# EAGLE design DoubleMotorSwitch (EAGLE 6.6.0)
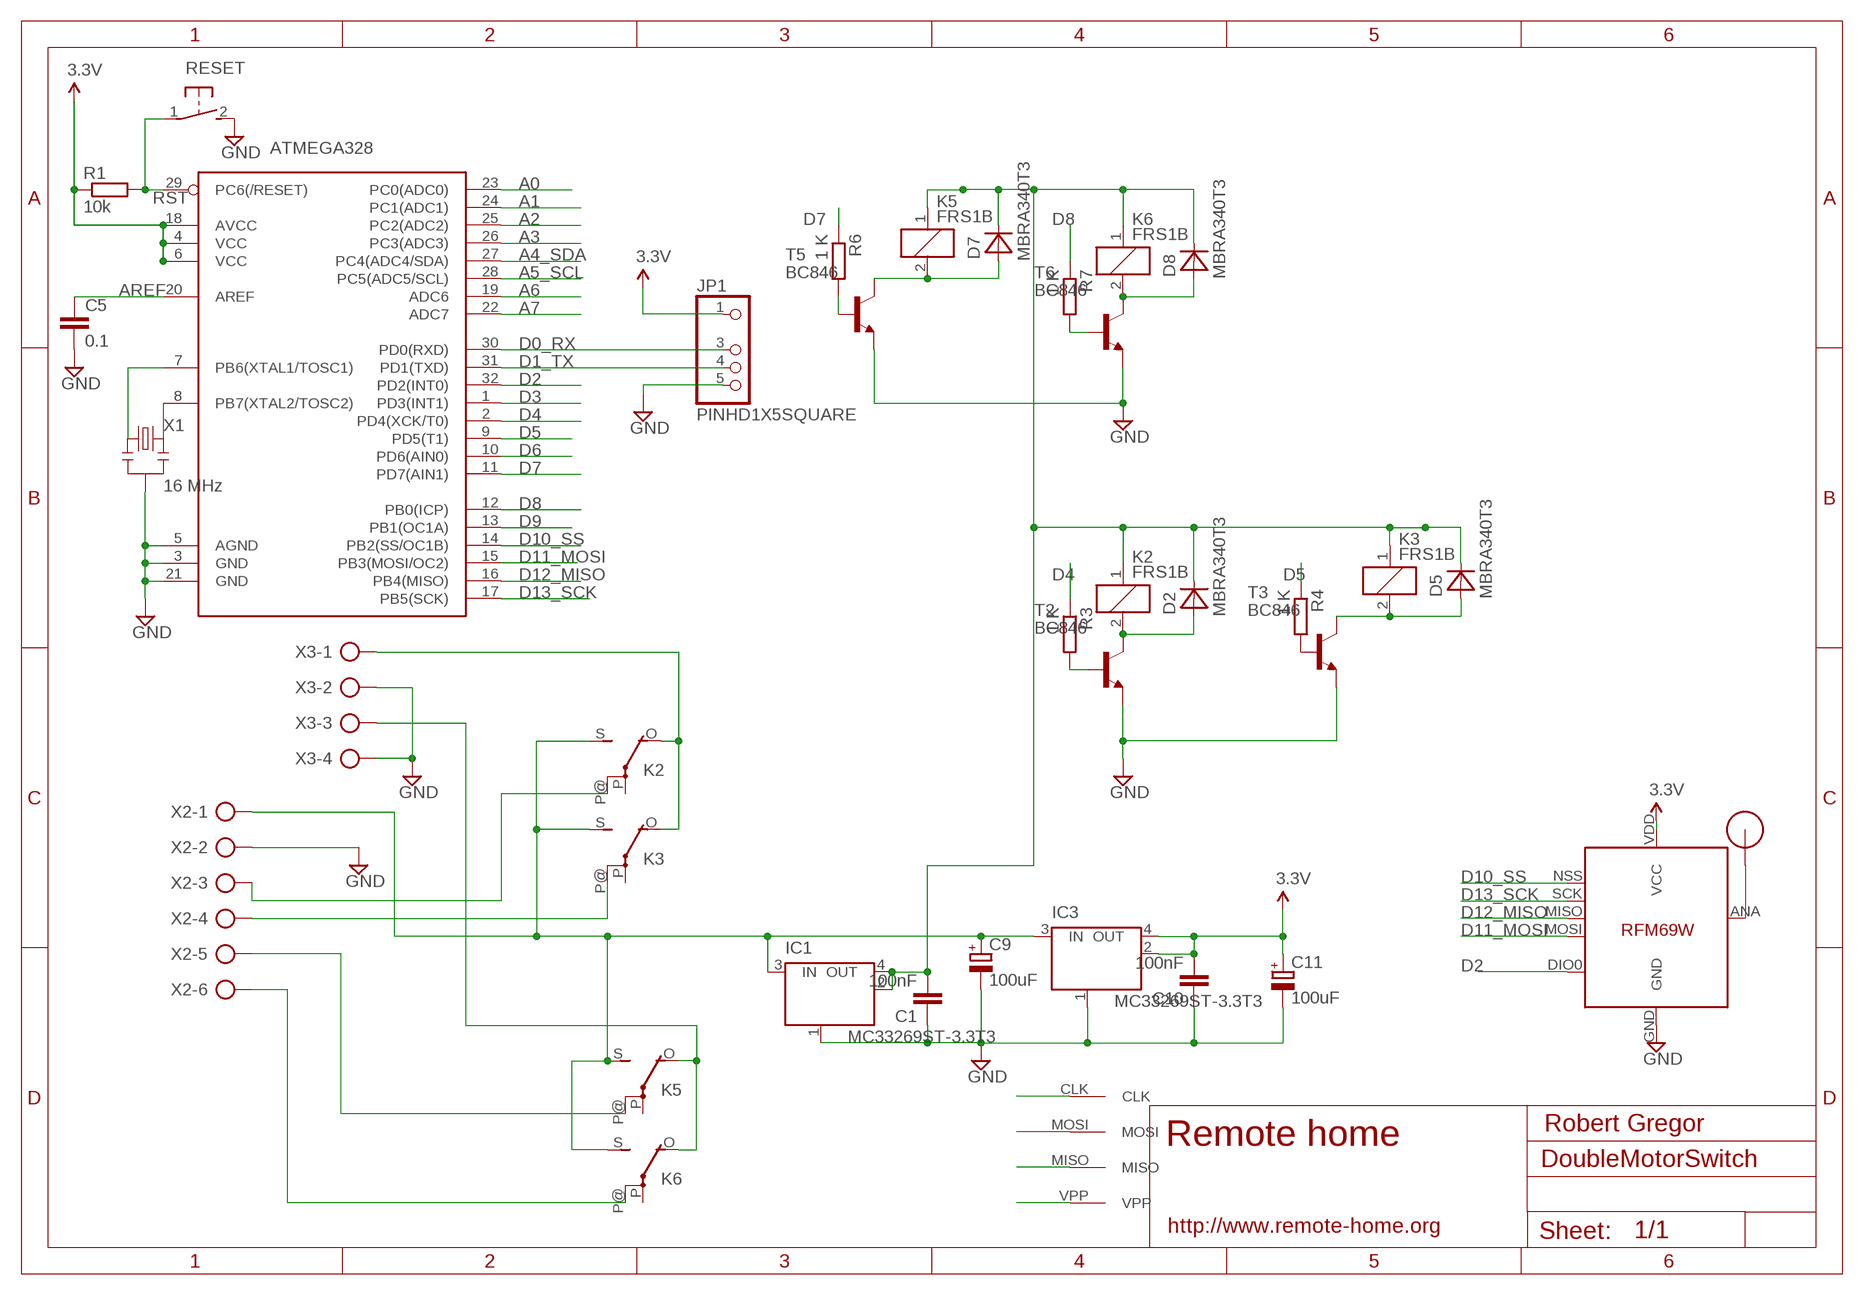
[diagram p0: schematic, sheet 1]

## Parts
ATMEGA328  ATMega-328  ATMEGA168/328TQFP32  [TQFP32-08]
C1  100nF  C-EUC2012  [C2012]
C5  0.1  C-EUC2012  [C2012]
C9  100uF  CPOL-EUSMCB  [SMC_B]
C10  100nF  C-EUC2012  [C2012]
C11  100uF  CPOL-EUSMCB  [SMC_B]
D2  MBRA340T3  [SMA]
D5  MBRA340T3  [SMA]
D7  MBRA340T3  [SMA]
D8  MBRA340T3  [SMA]
IC1  MC33269ST-3.3T3  [SOT223]
IC3  MC33269ST-3.3T3  [SOT223]
JP1  PINHD1X5SQUARE  [PINHD1X05-SQUARE]
K2  FRS1B  [FRS1B]
K3  FRS1B  [FRS1B]
K5  FRS1B  [FRS1B]
K6  FRS1B  [FRS1B]
R1  10k  R-EU_R2012  [R2012]
R3  1 K  R-EU_M2012  [M2012]
R4  1 K  R-EU_M2012  [M2012]
R6  1 K  R-EU_M2012  [M2012]
R7  1 K  R-EU_M2012  [M2012]
RESET  DTSM-3  [DTSM-3]
T2  BC846  [SOT23]
T3  BC846  [SOT23]
T5  BC846  [SOT23]
T6  BC846  [SOT23]
U$1  RFM12B_ANTENNA  [RFM12B-ANTENNA]
U$2  AVRHEADERDIP  [AVRHEADER]
U$5  RFM69  [RFM69W-MINPADS]
X1  16 MHz  RESONATORSMD  [RESONATOR-SMD]
X2  AK500/6  [AK500/6]
X3  AK500/4  [AK500/4]

## Nets
5V1: C1.2 D2.C D5.C D7.C D8.C IC1.2(OUT) IC1.4(OUT) K2.1 K3.1 K5.1 K6.1
A0: ATMEGA328.23(PC0(ADC0))
A1: ATMEGA328.24(PC1(ADC1))
A2: ATMEGA328.25(PC2(ADC2))
A3: ATMEGA328.26(PC3(ADC3))
A4_SDA: ATMEGA328.27(PC4(ADC4/SDA))
A5_SCL: ATMEGA328.28(PC5(ADC5/SCL))
A6: ATMEGA328.19(ADC6)
A7: ATMEGA328.22(ADC7)
AREF: ATMEGA328.20(AREF) C5.1
D0_RX: ATMEGA328.30(PD0(RXD)) JP1.3
D1_TX: ATMEGA328.31(PD1(TXD)) JP1.4
D2: ATMEGA328.32(PD2(INT0)) U$5.DIO0
D3: ATMEGA328.1(PD3(INT1))
D4: ATMEGA328.2(PD4(XCK/T0)) R3.1
D5: ATMEGA328.9(PD5(T1)) R4.1
D6: ATMEGA328.10(PD6(AIN0))
D7: ATMEGA328.11(PD7(AIN1)) R6.1
D8: ATMEGA328.12(PB0(ICP)) R7.1
D9: ATMEGA328.13(PB1(OC1A))
D10_SS: ATMEGA328.14(PB2(SS/OC1B)) U$5.NSS(SEL)
D11_MOSI: ATMEGA328.15(PB3(MOSI/OC2)) U$2.MOSI U$5.MOSI
D12_MISO: ATMEGA328.16(PB4(MISO)) U$2.MISO U$5.MISO
D13_SCK: ATMEGA328.17(PB5(SCK)) U$2.CLK U$5.SCK
GND [power]: ATMEGA328.3(GND) ATMEGA328.5(AGND) ATMEGA328.21(GND) C1.1 C5.2 C9.- C10.1 C11.- IC1.1(GND/ADJ) IC3.1(GND/ADJ) JP1.5 RESET.2 T2.2(E) T3.2(E) T5.2(E) T6.2(E) U$5.GND X1.2 X2.2 X3.2 X3.4
N$1: ATMEGA328.7(PB6(XTAL1/TOSC1)) X1.1
N$3: U$1.P$1 U$5.ANA(ANT)
N$4: D2.A K2.2 T2.3(C)
N$6: R3.2 T2.1(B)
N$7: K2.P@(2:P) X2.3
N$9: K2.O(2:O) K3.O(2:O) X3.1
N$11: K3.P@(2:P) X2.4
N$13: K5.O(2:O) K6.O(2:O) X3.3
N$15: C9.+ IC1.3(IN) IC3.3(IN) K2.S(2:S) K3.S(2:S) K5.S(2:S) K6.S(2:S) X2.1
N$16: K5.P@(2:P) X2.5
N$17: K6.P@(2:P) X2.6
N$21: ATMEGA328.8(PB7(XTAL2/TOSC2)) X1.3
N$22: D5.A K3.2 T3.3(C)
N$24: R4.2 T3.1(B)
N$27: D7.A K5.2 T5.3(C)
N$28: R6.2 T5.1(B)
N$29: D8.A K6.2 T6.3(C)
N$30: R7.2 T6.1(B)
RST: ATMEGA328.29(PC6(/RESET)) R1.2 RESET.1 U$2.VPP
VCC: ATMEGA328.4(VCC) ATMEGA328.6(VCC) ATMEGA328.18(AVCC) C10.2 C11.+ IC3.2(OUT) IC3.4(OUT) JP1.1 R1.1 U$5.VDD(VCC) ; supply symbol labelled 3.3V
Unconnected: K2.P(2:P) K3.P(2:P) K5.P(2:P) K6.P(2:P)

## Notes on the sheet
- Robert Gregor
- Remote home
- http://www.remote-home.org

## Library data of the parts
ATMEGA328 = LowPowerLab:ATMEGA168/328: Atmel 32-pin 8-bit micro, 16k flash.
C1 C5 C10 = resistor:C-EU: CAPACITOR, European symbol
C9 C11 = resistor:CPOL-EU: POLARIZED CAPACITOR, European symbol
D2 D5 D7 D8 = diode:MBRA340T3: Surface Mount Schottky Power Rectifier Source: http://www.onsemi.com/pub_link/Collateral/MBRA340T3-D.PDF
IC1 IC3 = linear:MC33269ST*: Adjustable Output Low Dropout Voltage Regulator 800 mA Source: http://www.onsemi.com/pub/Collateral/MC33269-D.PDF
JP1 = eagle-library-edeca.net-v5:PINHD1X5
K2 K3 K5 K6 = relay:FRS1B: RELAY 1 x switch, same as V23101-D6-A201, Siemens; OC_FARNELL: unknown; OC_NEWARK: unknown
R1 R3 R4 R6 R7 = resistor:R-EU_: RESISTOR, European symbol
RESET = switch-tact:DTSM-3
T2 T3 T5 T6 = transistor:BC846: NPN TRANSISTOR
U$1 = LowPowerLab:RFM12B_ANTENNA
U$2 = RemoteHome:AVRHEADER
U$5 = LowPowerLab:RFM69
X1 = SparkFun:RESONATOR: Resonator Small SMD resonator. This is the itty bitty 10/20MHz resonators with built in caps. CSTCE10M0G55 and CSTCE20M0V53. Footprint has been reviewed closely but hasn't been tested yet.
X2 = con-ptr500:AK500/6: CONNECTOR; OC_FARNELL: unknown; OC_NEWARK: unknown
X3 = con-ptr500:AK500/4: CONNECTOR; OC_FARNELL: unknown; OC_NEWARK: unknown

## Net classes
1 power: width 0.381 mm, clearance 0.254 mm
2 220V: width 0.381 mm, clearance 0.508 mm

## Board
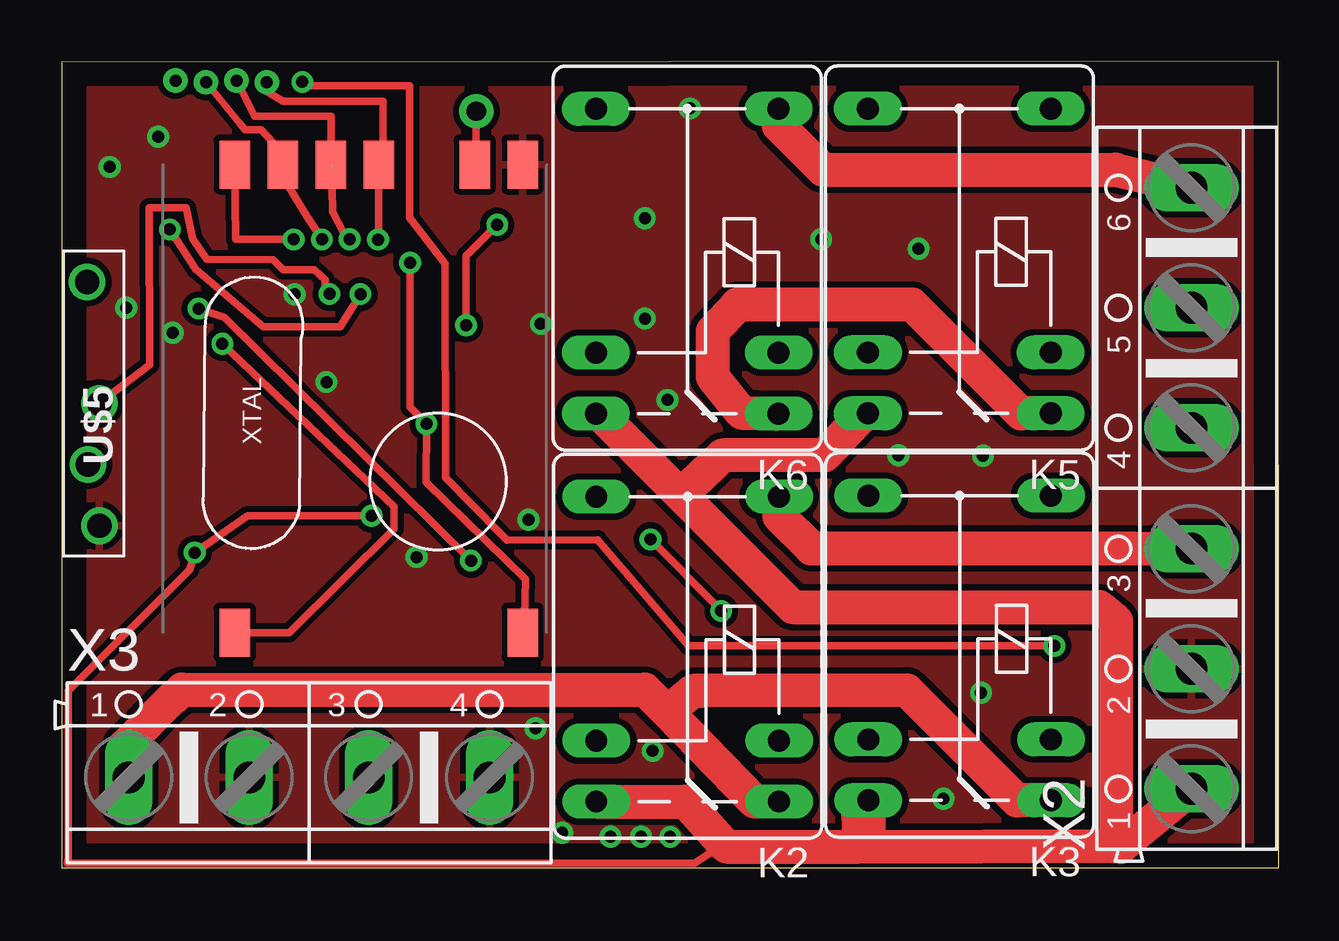
[diagram p1: board, top side]
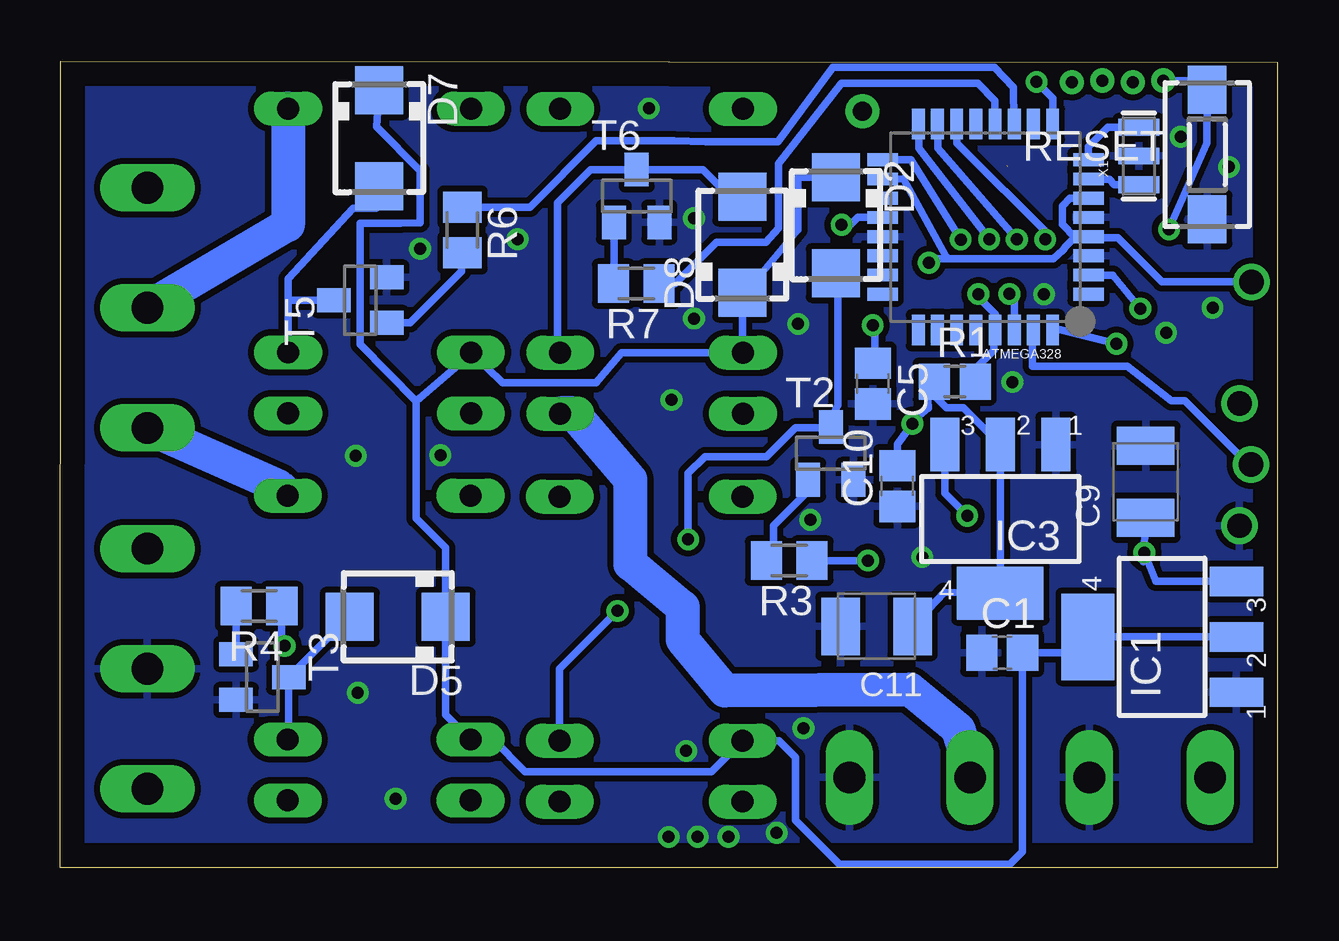
[diagram p2: board, bottom side, seen from below]

Size 50.74 x 33.59 mm. Coordinates in mm from the lower left corner, seen from the top.
Outline: 0,0 50.74,0 50.72,33.59 0,33.57 0,0
Copper layers (1*16): Top 0.035mm / dielectric 1.5mm / Bottom 0.035mm
Design rules "default": minimum track width 10mil, minimum drill 24mil, track to track 8mil, track to pad 8mil, pad to pad 8mil, via to via 8mil, smd to smd 8mil, copper to edge 40mil, drill to drill 8mil, minimum pad ring 10mil, minimum via ring 8mil, stop-mask expansion 4mil, vias tented up to drill 0mil, thermal gap 10mil

### Footprints (pad centres in the part's own frame; a part is rotated, then mirrored left to right if it is on the bottom)
TQFP32-08 = smd 1.27 x 0.533: 1 -4.293,2.8; 2 -4.293,2; 3 -4.293,1.2; 4 -4.293,0.4; 5 -4.293,-0.4; 6 -4.293,-1.2; 7 -4.293,-2; 8 -4.293,-2.8; 17 4.293,-2.8; 18 4.293,-2; 19 4.293,-1.2; 20 4.293,-0.4; 21 4.293,0.4; 22 4.293,1.2; 23 4.293,2; 24 4.293,2.8 | smd 0.533 x 1.27: 9 -2.8,-4.293; 10 -2,-4.293; 11 -1.2,-4.293; 12 -0.4,-4.293; 13 0.4,-4.293; 14 1.2,-4.293; 15 2,-4.293; 16 2.8,-4.293; 25 2.8,4.293; 26 2,4.293; 27 1.2,4.293; 28 0.4,4.293; 29 -0.4,4.293; 30 -1.2,4.293; 31 -2,4.293; 32 -2.8,4.293
C2012 = smd 1.3 x 1.5: 1 -0.85,0; 2 0.85,0
SMC_B = smd 1.6 x 2.4: + -1.5,0; - 1.5,0
SMA = smd 2 x 2: A 2,0; C -2,0
SOT223 = smd 1.219 x 2.235: 1 -2.311,-3.099; 2 0,-3.099; 3 2.311,-3.099 | smd 3.6 x 2.2: 4 0,3.099
PINHD1X05-SQUARE = drill 1.016: 1 -5.061,-0.269; 3 0,0.24; 4 2.54,-0.24; 5 5.099,0.24
FRS1B = drill 0.914 long: 1 0,3.81; 2 0,-3.81; O -2.54,-3.81; P 10.16,3.81; P@ 10.16,-3.81; S -2.54,3.81
R2012 = smd 1.3 x 1.5: 1 -0.85,0; 2 0.85,0
M2012 = smd 1.3 x 1.6: 1 -0.95,0; 2 0.95,0
DTSM-3 = smd 2 x 1.6: 1 -2.7,0; 2 2.7,0
SOT23 = smd 1 x 1.4: 1 -0.95,-1.1; 2 0.95,-1.1; 3 0,1.1
RFM12B-ANTENNA = drill 0.8 pad 1.422: P$1 0,0
AVRHEADER = drill 0.5: CLK 2.54,0; MISO 1.27,0.07; MOSI 0,0; VPP -1.27,0.072
RFM69W-MINPADS = smd 2 x 1.27: ANA 8,-5; DIO0 -11.5,5; GND 8,-7; MISO 8,1; MOSI 8,3; NSS 8,5; SCK 8,-1; VDD -11.5,-7
RESONATOR-SMD = smd 0.7 x 1.7: 1 -1.2,0; 2 0,0; 3 1.2,0
AK500/6 = drill 1.321 long: 1 -12.522,0; 2 -7.518,0; 3 -2.515,0; 4 2.515,0; 5 7.518,0; 6 12.522,0
AK500/4 = drill 1.321 long: 1 -7.518,0; 2 -2.489,0; 3 2.489,0; 4 7.518,0

### Placement (x,y rotation side)
ATMEGA328  12.16,26.69 180 bottom
C1  11.47,8.96 0 bottom
C5  16.86,20.18 270 bottom
C9  5.49,16.08 90 bottom
C10  15.84,15.9 90 bottom
C11  16.7,10.06 180 bottom
D2  18.4,26.77 270 bottom
D5  36.67,10.45 180 bottom
D7  37.44,30.4 270 bottom
D8  22.3,25.96 90 bottom
IC1  4.8,9.62 90 bottom
IC3  11.55,14.53 180 bottom
JP1  1.34,19.35 270 top
K2  26.1,5.3 90 top
K3  37.44,5.34 90 top
K5  37.42,21.47 90 top
K6  26.08,21.46 90 top
R1  13.44,20.25 0 bottom
R3  20.34,12.8 180 bottom
R4  42.44,10.9 180 bottom
R6  33.97,26.57 270 bottom
R7  26.72,24.34 180 bottom
RESET  2.92,29.71 270 bottom
T2  18.61,17.27 0 bottom
T3  42.3,7.95 270 bottom
T5  38.22,23.65 90 bottom
T6  26.7,27.99 0 bottom
U$1  17.29,31.52 0 top
U$2  6.02,32.73 0 top
U$5  12.23,21.29 90 top
X1  5.77,29.66 90 bottom
X2  47.1,15.81 90 top
X3  10.32,3.76 0 top

### Tracks (layer width: path | path; a pad name or v marks a point on that pad's centre or on a via)
5V1
  Bottom 0.305: 35.89,19.44 35.89,14.56 34.67,13.34 D5.C 34.67,6.38 K3.1 32.7,5.34 31.36,4 23.58,4 K2.1 22.28,5.29 20.77,5.29 20.09,4.6 20.09,1.98 18.25,0.14 11.14,0.14 10.62,0.67 C1.2 8.92,8.96 IC1.4 IC1.2 | 35.89,19.44 34.59,20.56 34.15,20.93 K5.1 32.28,20.2 28.4,20.2 27.33,21.46 K6.1 22.3,21.49 D8.C 22.17,23.96 19.98,26.59 19.98,28.77 D2.C | D7.C 37.54,30.86 35.72,29.05 35.72,26.88 36.54,26.86 38.23,26.86 38.24,25.42 38.24,21.82 35.89,19.44
AREF  (via drill 0.5)
  Top 0.305: v16.87,22.6 16.87,25.5 v18.16,26.8
  Bottom 0.305: C5.1 16.78,21.19 | 16.78,21.19 16.64,21.16 16.83,20.99 | 16.78,21.19 16.78,22.52 v16.87,22.6 | v18.16,26.8 17.79,26.8 17.49,27.09 ATMEGA328.20
D0_RX  (via drill 0.5)
  Top 0.305: v11.17,23.91 10.98,23.94 10.99,24.5 10.54,24.91 9.24,24.91 8.82,25.33 6.05,25.36 5.46,26.22 5.2,27.5 3.66,27.5 3.68,20.95 JP1.3
  Bottom 0.305: ATMEGA328.30 10.96,23.66 v11.17,23.91
D1_TX
  Bottom 0.305: JP1.4 1.2,16.81 3.85,19.45 4.42,19.45 6.25,20.89 10.2,20.89 10.2,22.4 ATMEGA328.31
D2  (via drill 0.5)
  Top 0.305: U$5.DIO0 9.5,9.79 13.87,14.13 13.87,15.04 v6.7,21.84
  Bottom 0.305: v6.7,21.84 9.29,22.47 ATMEGA328.32
D4  (via drill 0.5)
  Top 0.305: v5.71,23.3 6.78,22.94 v17.06,12.8
  Bottom 0.305: ATMEGA328.2 6.86,24.69 v5.71,23.3 | v17.06,12.8 R3.1
D5  (via drill 0.5)
  Top 0.305: v41.38,9.24 26.14,9.24 22.34,13.67 18.57,13.65 18.3,13.92 16,16.24 16,25.17 14.52,27.08 14.52,28.79 14.51,32.59 10.23,32.59 v10.04,32.74
  Bottom 0.305: R4.1 41.49,9.35 v41.38,9.24 | ATMEGA328.9 9.36,32.07 v10.04,32.74
D7
  Bottom 0.305: R6.1 31.14,27.52 28.39,30.3 25.14,30.3 23.83,30.25 20.82,30.25 18.52,33.35 11.8,33.35 11,32.51 11,32.1 ATMEGA328.11
D8
  Bottom 0.305: R7.1 25.11,24.34 23.38,26.07 21.3,26.07 20.8,26.65 20.8,29.33 18.16,32.69 12.48,32.7 11.76,31.95 ATMEGA328.12
D10_SS  (via drill 0.5)
  Top 0.305: U$5.NSS 7.26,26.2 v9.68,26.18
  Bottom 0.305: v9.68,26.18 9.4,26.24 13.36,30.2 13.36,30.98 ATMEGA328.14
D11_MOSI  (via drill 0.5)
  Top 0.305: U$5.MOSI 9.29,29.13 | U$2.MOSI 7.43,31.01 7.65,30.75 8.33,30.75 9.31,29.68 9.31,29.38 U$5.MOSI | v10.85,26.18 10.24,27.13 9.79,27.87 9.24,28.78 U$5.MOSI
  Bottom 0.305: ATMEGA328.15 14.15,29.98 v10.85,26.18
D12_MISO  (via drill 0.5)  (1 unrouted)
  Top 0.305: U$2.MISO 8.06,31.3 8.86,31.31 11.23,31.32 11.25,29.21 | v12.01,26.18 11.8,26.39 11.3,27.34 11.26,29.26 U$5.MISO
  Bottom 0.305: ATMEGA328.16 14.95,29.98 v12.01,26.18
D13_SCK  (via drill 0.5)
  Top 0.305: U$2.CLK 8.58,32.34 9.24,31.93 13.4,31.93 13.41,29.69 U$5.SCK 13.23,26.2 v13.2,26.18
  Bottom 0.305: ATMEGA328.17 15.28,29.5 v13.2,26.18
GND  (via drill 0.5)
  other vias: 11.04,20.24 35.73,25.79 31.67,26.18 24.32,27.06 24.32,22.88 25.25,19.49 38.33,7.29 36.75,2.87 9.72,23.9 38.41,17.17 26.2,31.64 19.75,5.82 24.64,4.87 25.37,1.28 20.87,1.45 22.88,1.29 24.16,1.29 19.47,14.5 2.01,29.2 4.64,22.29 4.03,30.46 34.88,17.19 2.7,23.34 14.8,12.94 19.98,22.66
  pour Top: 19.82,33.38 0.08,33.49 0.17,28.41 0.17,3.24 0.27,0.15 13.13,0.26 17.56,0.18 19.2,0.17 20.39,0.18 50.61,0.14 50.55,33.34 25.31,33.4
  pour Bottom: 18.01,33.39 0.13,33.47 0.2,0.17 50.6,0.19 50.58,26.05 50.57,33.4
N$1
  Bottom 0.305: ATMEGA328.7 7.01,28.69 6.78,28.47 X1.1
N$3
  Top 0.305: U$5.ANA 17.26,29.27 U$1.P$1
N$4  (via drill 0.5)
  Top 0.305: v27.5,10.7 27.5,10.73 v24.56,13.68
  Bottom 0.305: D2.A 18.32,23.96 18.32,22.59 18.31,21.89 18.31,19.27 18.61,18.72 T2.3 18.65,18.33 20.09,18.33 21.29,17.13 23.86,17.13 24.56,16.44 v24.56,13.68 | K2.2 29.91,8.29 v27.5,10.7
N$6
  Bottom 0.305: T2.1 19.56,15.69 20.99,14.26 20.99,13.5 R3.2
N$7
  Top 1.422: K2.P@ 29.91,14.65 31.26,13.3 44.68,13.3 X2.3
N$9
  Top 1.422: K3.O 39.83,2.8 35.24,7.39 26.62,7.37 26.33,7.37 25.27,6.47 | K2.O 28.89,2.76 25.27,6.47 | X3.1 2.65,5.08 4.66,7.1 4.7,7.1 5.02,7.42 24.32,7.42 25.27,6.47
N$11
  Bottom 1.422: X2.4 41.65,15.91 K3.P@
N$13
  Top 1.422: K5.O 40,18.93 35.46,23.46 28.17,23.46 27.14,22.35 27.14,20.46 28.34,18.96 29.77,18.92 K6.O
  Bottom 1.422: K6.O 29.88,18.93 29.34,18.93 26.97,16.17 26.97,12.66 24.78,10.86 24.79,9.51 23.04,7.39 15.31,7.43 13.3,5.79 12.7,3.81 X3.3
N$15  (via drill 0.5)
  Top 0.305: v12.93,14.67 7.76,14.67 v5.55,13.13 5.34,12.42 0.29,7.37 0.29,0.38 0.24,0.19 26.39,0.19 27.43,0.87 27.59,0.87 27.66,0.95
  Top 1.422: K2.S 26.03,2.76 27.66,0.95 27.72,0.88 33.25,0.88 33.22,2.39 K3.S 33.63,1.11 33.25,0.88 43.58,0.91 | K6.S 22.42,18.92 25.82,15.52 | 25.82,15.52 30.49,10.86 43.25,10.86 43.95,10.29 43.95,1.08 43.58,0.91 | K5.S 33.45,18.93 31.79,17.18 27.57,17.18 25.82,15.52 | 43.58,0.91 44.16,0.87 X2.1
  Bottom 0.305: C9.+ 5.57,12.74 v5.55,13.13 5.06,11.93 IC1.3 | IC3.3 13.86,15.6 v12.93,14.67
N$16
  Bottom 1.422: K5.P@ 41.23,26.78 X2.5
N$17
  Top 1.422: K6.P@ 29.89,30.93 31.74,29.09 43.93,29.09 X2.6
N$21
  Bottom 0.305: ATMEGA328.8 7.87,30.04 7.05,30.86 X1.3 | X1.3
N$22
  Bottom 0.305: D5.A 38.7,10.45 T3.3 41.2,5.39 K3.2
N$24
  Bottom 0.305: R4.2 T3.1
N$27
  Bottom 0.305: K5.2 41.23,23.58 | 41.23,23.58 41.23,24.55 38.52,27.48 37.57,27.48 D7.A | T5.3 41.16,23.65 41.23,23.58
N$28
  Bottom 0.305: T5.1 36.15,22.7 34,24.85 34,25.59 R6.2
N$29
  Bottom 0.305: D8.A 22.82,27.96 23.93,29.07 26.69,29.07 T6.3 28.62,29.09 30,27.71 30,21.57 K6.2
N$30
  Bottom 0.305: T6.1 27.65,24.36 R7.2
RST  (via drill 0.5)
  Top 0.305: v4.51,26.6 5.59,24.94 8.4,22.53 11.62,22.53 v12.46,23.9
  Bottom 0.305: U$2.VPP 3.51,32.8 2.84,32.8 2.83,32.06 RESET.1 2.94,30.19 v4.51,26.6 | R1.2 12.59,20.78 11.82,21.55 11.82,22.35 ATMEGA328.29 11.76,23.05 12.45,23.74 v12.46,23.9
VCC  (via drill 0.5)
  Top 0.305: U$5.VDD 19.26,8.96 19.34,12.03 15.21,16.07 v15.21,18.5 14.53,19.18 v14.53,25.21
  Bottom 0.305: ATMEGA328.18 15.58,28.7 13.81,25.47 13.71,25.37 | C10.2 15.84,17.64 v15.21,18.5 15.26,18.55 14.54,19.14 14.61,20.25 R1.1 14.29,19.67 13.79,19.17 13.08,19.17 IC3.2 IC3.4 13.87,11.48 C11.+ | 8.44,26.28 8.84,25.88 8.92,25.75 9.34,25.37 13.71,25.37 | 8.44,26.28 7.89,26.28 ATMEGA328.4 7.83,26.25 6.65,26.25 4.81,24.41 JP1.1 | ATMEGA328.6 8.64,27.89 8.97,27.56 8.97,26.8 8.44,26.28 | 13.71,25.37 14.49,25.37 v14.53,25.21